# EasyEDA Pro project ProProject_3516_307_8731_devboard_V1.1_2024-05-14.epro, schematic 3516aio_v1p1
Create Date: 2024-05-11; Page Name: P1; Project Name: hi3516ev200_imx307_rtl8731bu_aio_v1p1_rel; Schematic Name: Schematic1_2; Update Date: 2024-05-11; Company: 嘉立创EDA; Drawed: @libc0607; Page Size: A4; Version: V1.0
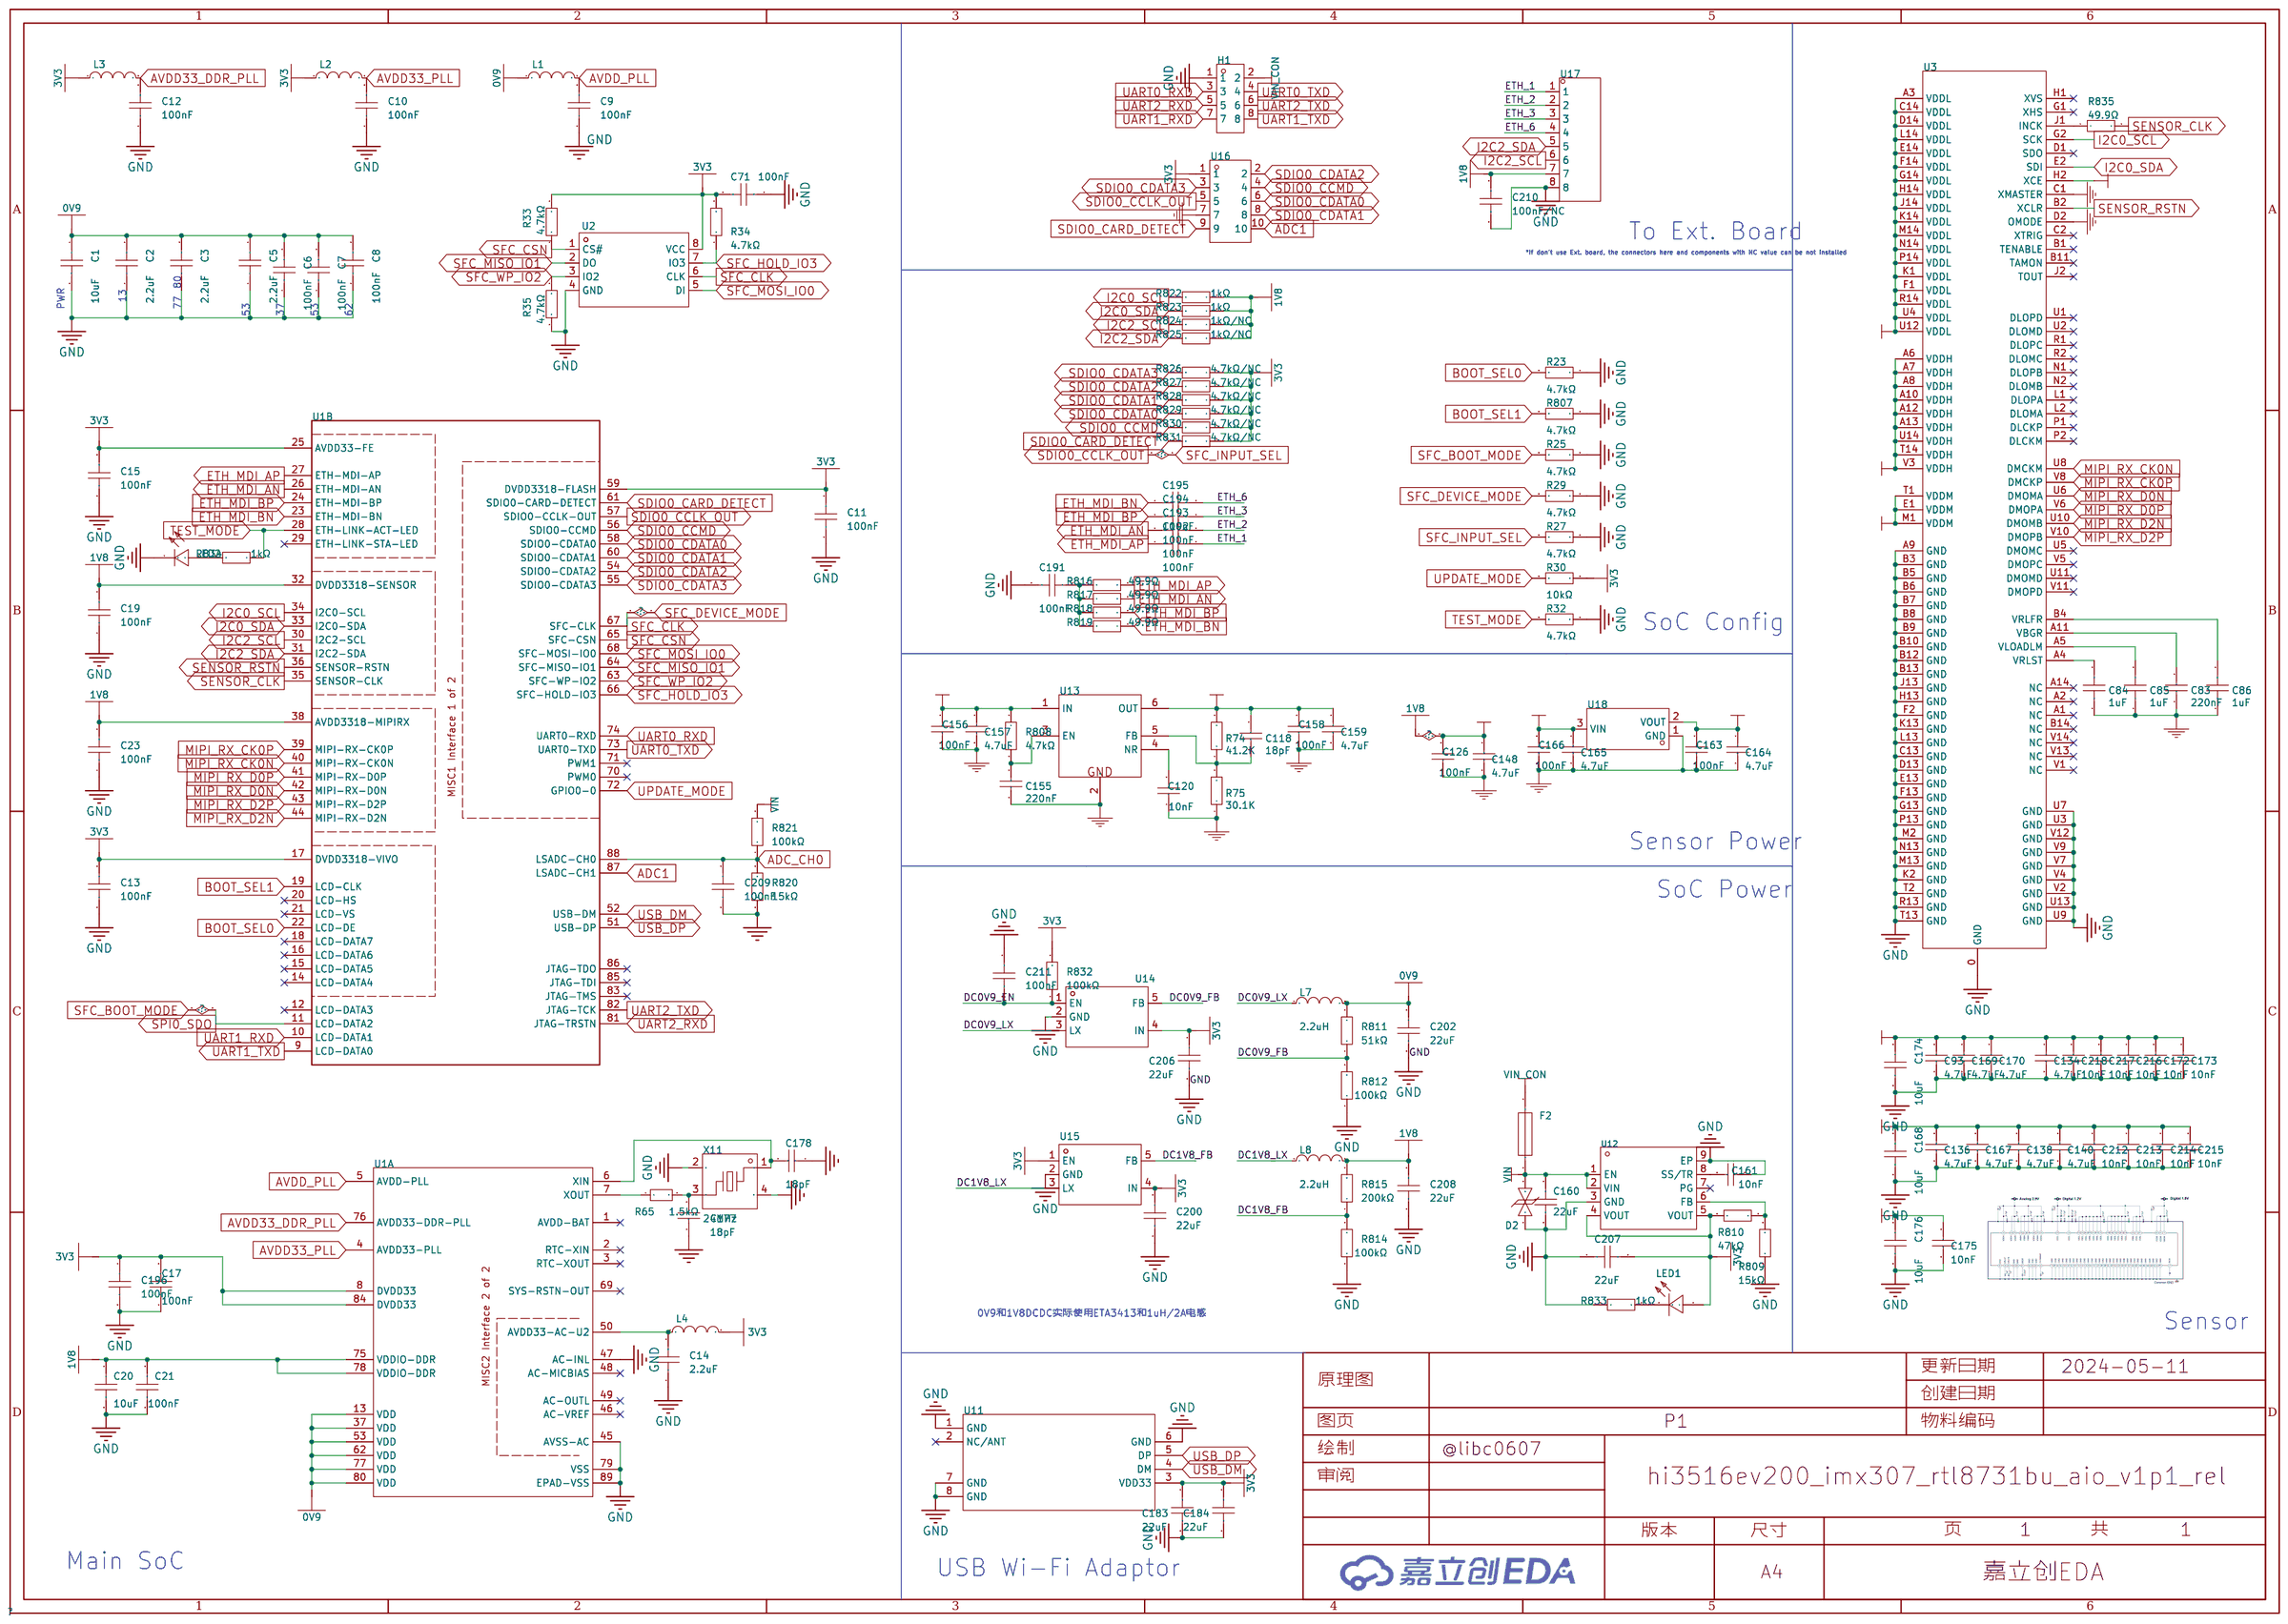
[diagram p0: schematic sheet]

## Parts
C1  10uF  [0402]
C2  2.2uF  [0402]
C3  2.2uF  [0402]
C5  2.2uF  [0402]
C6  100nF  [0402]
C7  100nF  [0402]
C8  100nF  [0402]
C9  100nF  [0402]
C10  100nF  [0402]
C11  100nF  [0402]
C12  100nF  [0402]
C13  100nF  [0402]
C14  2.2uF  [0402]
C15  100nF  [0402]
C17  100nF  [0402]
C19  100nF  [0402]
C20  10uF  [0402]
C21  100nF  [0402]
C23  100nF  [0402]
C71  100nF  [0402]
C83  220nF  [0402]
C84  1uF  [0402]
C85  1uF  [0402]
C86  1uF  [0402]
C93  4.7uF  [0402]
C118  18pF  [0402]
C120  10nF  [0402]
C126  100nF  [0402]
C134  4.7uF  [0402]
C136  4.7uF  [0402]
C138  4.7uF  [0402]
C140  4.7uF  [0402]
C148  4.7uF  [0402]
C155  220nF  [0402]
C156  100nF  [0402]
C157  4.7uF  [0402]
C158  100nF  [0402]
C159  4.7uF  [0402]
C160  22uF  [0805]
C161  10nF  [0402]
C163  100nF  [0402]
C164  4.7uF  [0402]
C165  4.7uF  [0402]
C166  100nF  [0402]
C167  4.7uF  [0402]
C168  10uF  [0402]
C169  4.7uF  [0402]
C170  4.7uF  [0402]
C172  10nF  [0402]
C173  10nF  [0402]
C174  10uF  [0402]
C175  10nF  [0402]
C176  10uF  [0402]
C177  18pF  [0402]
C178  18pF  [0402]
C183  22uF  [0805]
C184  22uF  [0805]
C191  100nF  [0402]
C192  100nF  [0402]
C193  100nF  [0402]
C194  100nF  [0402]
C195  100nF  [0402]
C196  100nF  [0402]
C200  22uF  [0603]
C202  22uF  [0603]
C206  22uF  [0805]
C207  22uF  [0805]
C208  22uF  [0805]
C209  100nF  [0402]
C210  100nF/NC  [0402]
C211  100nF  [0402]
C212  10nF  [0402]
C213  10nF  [0402]
C214  10nF  [0402]
C215  10nF  [0402]
C216  10nF  [0402]
C217  10nF  [0402]
C218  10nF  [0402]
D2  PESD12VL1BA-N  [SOD-323_L1.8-W1.3-LS2.5-BI]
F2  BSMD0805-075-12V  [F0805]
H1  PM127V-12-08-H43  [HDR-TH_8P-P1.27-V-F-R2-C4-S1.27]
L1  -  [0402]
L2  -  [0402]
L3  -  [0402]
L4  -  [0402]
L7  2.2uH  [0805]
L8  2.2uH  [0805]
LED1  KT-0603R  [0603]
LED2  19-213/Y2C-CQ2R2L/3T(CY)  [0603]
R23  4.7kΩ  [0402]
R25  4.7kΩ  [0402]
R27  4.7kΩ  [0402]
R29  4.7kΩ  [0402]
R30  10kΩ  [0402]
R32  4.7kΩ  [0402]
R33  4.7kΩ  [0402]
R34  4.7kΩ  [0402]
R35  4.7kΩ  [0402]
R65  1.5kΩ  [0402]
R74  41.2K  [0402]
R75  30.1K  [0402]
R807  4.7kΩ  [0402]
R808  4.7kΩ  [0402]
R809  15kΩ  [0402]
R810  47kΩ  [0402]
R811  51kΩ  [0402]
R812  100kΩ  [0402]
R814  100kΩ  [0402]
R815  200kΩ  [0402]
R816  49.9Ω  [0402]
R817  49.9Ω  [0402]
R818  49.9Ω  [0402]
R819  49.9Ω  [0402]
R820  15kΩ  [0402]
R821  100kΩ  [0402]
R822  1kΩ  [0402]
R823  1kΩ  [0402]
R824  1kΩ/NC  [0402]
R825  1kΩ/NC  [0402]
R826  4.7kΩ/NC  [0402]
R827  4.7kΩ/NC  [0402]
R828  4.7kΩ/NC  [0402]
R829  4.7kΩ/NC  [0402]
R830  4.7kΩ/NC  [0402]
R831  4.7kΩ/NC  [0402]
R832  100kΩ  [0402]
R833  1kΩ  [0402]
R834  1kΩ  [0402]
R835  49.9Ω  [0402]
U1  -  [QFN-88 L9.0-W9.0-P0.35-BL-EP5.26]  (sections 1,2)
U2  -  [SOIC-8_L5.3-W5.3-P1.27-LS8.0-BL]
U3  -  [IMX307LQD-C__NO_IRCUT]
U11  -  [BL-M8731BU4]
U12  TPS82130SILR  [USIP-8_L3.0-W2.8-P0.65-TL-EP]
U13  TPS79301DBVR  [SOT-23-6_L2.9-W1.6-P0.95-LS2.8-BR]
U14  SY8088AAC  [SOT-23-5_L3.0-W1.7-P0.95-LS2.8-BR]
U15  SY8088AAC  [SOT-23-5_L3.0-W1.7-P0.95-LS2.8-BR]
U16  ZX-PM1.27-2-5PU  [HDR-TH_10P-P1.27-V-F-R2-C5-S1.27]
U17  2343U-108CNG1SNT01  [HDR-TH_8P-P1.27-V-F]
U18  XC6206P122MR(1uA)  [SOT-23-3_L2.9-W1.6-P1.90-LS2.8-BR]
X11  24MHz  [CRYSTAL-SMD_4P-L2.0-W1.6-BL]

## Library data of the parts
C1-C3 C5-C15 C17 C19-C21 C23 C71 C168 C174 C176 C191-C196 C209 C211 = CC0402KRX7R7BB104: 容值:100nF;精度:±10%;额定电压:16V;材质(温度系数):X7R;; LCSC Part Name: 100nF ±10% 16V; Supplier Part: C15195; Manufacturer: YAGEO(国巨); JLCPCB Part Class: Extended Part; Datasheet: https://atta.szlcsc.com/upload/public/pdf/source/20211223/9278FD768280B81DDBEF48FA36411A03.pdf; Supplier: LCSC; Tolerance: ±10%; Voltage Rated: 16V; Temperature Coefficient: X7R
C83 C155 = CL05B224KO5NNNC: Supplier: LCSC; Manufacturer: SAMSUNG; Supplier Part: C15195; JLCPCB Part Class: Basic
C84-C86 = CL05A105KA5NQNC: Supplier: LCSC; Manufacturer: SAMSUNG; Supplier Part: C15195; JLCPCB Part Class: Basic
C93 C134 C136 C138 C140 C148 C157 C159 C164 C165 C167 C169 C170 = CL05A475MP5NRNC: Supplier: LCSC; Manufacturer: SAMSUNG; Supplier Part: C15195; JLCPCB Part Class: Basic
C118 = 0402CG180J500NT: Supplier: LCSC; Manufacturer: FH; Supplier Part: C15195; JLCPCB Part Class: Basic
C120 C161 C172 C173 C175 C212-C218 = CL05B103KB5NNNC: Supplier: LCSC; Manufacturer: SAMSUNG; Supplier Part: C15195; JLCPCB Part Class: Basic
C126 C156 C158 C163 C166 = CL05B104KO5NNNC: Supplier: LCSC; Manufacturer: SAMSUNG; Supplier Part: C15195; JLCPCB Part Class: Basic
C160 C183 C184 C206-C208 = CL21A226MAQNNNE: 容值:22uF;精度:±20%;额定电压:25V;材质(温度系数):X5R;; LCSC Part Name: 22uF ±20% 25V; Supplier Part: C2838369; Manufacturer: SAMSUNG(三星); JLCPCB Part Class: 基础库; Datasheet: https://atta.szlcsc.com/upload/public/pdf/source/20160218/1457707763339.pdf; Supplier: LCSC; Tolerance: ±20%; Voltage Rated: 25V; Temperature Coefficient: X5R
C177 C178 = 0402CG180J500NT: 容值:18pF;精度:±5%;额定电压:50V;材质(温度系数):C0G;; LCSC Part Name: 18pF ±5% 50V; Supplier Part: C15195; Manufacturer: FH(风华); JLCPCB Part Class: 基础库; Datasheet: https://atta.szlcsc.com/upload/public/pdf/source/20200305/C486355_26A10D38EF8C2A5C37091D0039909270.pdf; Supplier: LCSC; Tolerance: ±5%; Voltage Rated: 50V; Temperature Coefficient: C0G
C200 C202 = CL10A226MQ8NRNC: 容值:22uF;精度:±20%;额定电压:6.3V;材质(温度系数):X5R;; LCSC Part Name: 22uF ±20% 6.3V; Supplier Part: C72038; Manufacturer: SAMSUNG(三星); JLCPCB Part Class: 基础库; Datasheet: https://atta.szlcsc.com/upload/public/pdf/source/20160218/1457707763339.pdf; Supplier: LCSC; Tolerance: ±20%; Voltage Rated: 6.3V; Temperature Coefficient: X5R
C210 = CC0402KRX7R7BB104: 容值:100nF;精度:±10%;额定电压:16V;材质(温度系数):X7R;; LCSC Part Name: 100nF ±10% 16V; Supplier Part: C60474; Manufacturer: YAGEO(国巨); JLCPCB Part Class: Extended Part; Datasheet: https://atta.szlcsc.com/upload/public/pdf/source/20211223/9278FD768280B81DDBEF48FA36411A03.pdf; Supplier: LCSC; Tolerance: ±10%; Voltage Rated: 16V; Temperature Coefficient: X7R
D2 = PESD12VL1BA-N: 极性:双向;反向截止电压(Vrwm):12V;最大钳位电压:26V;峰值脉冲电流(Ipp)@10/1000us:10A;击穿电压:13.3V;; LCSC Part Name: 双向ESD; Supplier Part: C314261; Manufacturer: BORN(伯恩半导体); Supplier Footprint: SOD-323; Datasheet: https://atta.szlcsc.com/upload/public/pdf/source/20181015/C314261_4290A578F6A9FDD8EB59F3EEFCEB14F5.pdf; Supplier: LCSC; polarity: 双向; Reverse Stand-Off Voltage (Vrwm): 12V; Maximum Clamping Voltage: 26V; Peak Pulse Current (Ipp)@10/1000us: 10A; Breakdown Voltage: 13.3V; Type: ESD
F2 = BSMD0805-075-12V: 最大电压:12V;最大电流:40A;保持电流:750mA;跳闸电流:1.5A;; LCSC Part Name: 12V 750mA 0805自恢复; Supplier Part: C883111; Manufacturer: BHFUSE(佰宏); Supplier Footprint: 0805; JLCPCB Part Class: 扩展库; Datasheet: https://atta.szlcsc.com/upload/public/pdf/source/20230512/7A46D6CD923C15CBB98FD769C08EDD80.pdf; Supplier: LCSC; Operating Voltage (Max): 12V; Current Rating (Max): 40A; Hold Current: 750mA; Trip Current: 1.5A; Power Dissipation: 600mW; Resistance - Initial (Ri) (Min): 70mΩ; Resistance - Post Trip (R1) (Max): 385mΩ; Maximum Time to Trip: 200ms; Operating Temperature: -40℃~+85℃
H1 = PM127V-12-08-H43: 排数:双排;总孔位数:8P;间距:1.27mm;插孔结构:2x4P;行距:1.27mm;安装类型:直插;圆孔/方孔:方孔;额定电流:1A;额定电压:250V;插孔方向:顶部;塑高:4.3mm;工作温度范围:-40℃~+105℃;; Supplier: LCSC; Supplier Part: C509139; Manufacturer: XFCN(兴飞); JLCPCB Part Class: 扩展库; LCSC Part Name: 间距:1.27mm 2x4P 直插; Supplier Footprint: 插件,P=1.27mm; Datasheet: https://atta.szlcsc.com/upload/public/pdf/source/20200407/C509139_3A6F8716DF7D61918E79FF2BB2D94EF1.pdf; Number of Rows: 双排; Number of Holes: 8P; Pitch: 1.27mm; Holes Structure: 2x4P; Row Spacing: 1.27mm; Mounting Type: 直插; Circular Hole / Square Hole: 方孔; Current Rating (Max): 1A; Voltage Rating (Max): 250V; Holes Direction: 顶部; Insulation Height: 4.3mm; Operating Temperature Range: -40℃~+105℃
L1-L4 = BLM15HG102SN1D: 标称阻抗@测试频率:1kΩ@100MHz;误差:±25%;直流电阻(RDC):1.1Ω;额定电流:250mA;电路数:1;; LCSC Part Name: 1kΩ@100MHz ±25%; Supplier Part: C15195; Manufacturer: muRata(村田); JLCPCB Part Class: Extended Part; Datasheet: https://atta.szlcsc.com/upload/public/pdf/source/20190514/C76889_F0F83FCD49F4171101F490FA7BA9BBE1.pdf; Supplier: LCSC; Impedance @ Frequency: 1kΩ@100MHz; Tolerance: ±25%; DC Resistance: 1.1Ω; Current Rating: 250mA; Circuits: 1
L7 L8 = DFE201612E-2R2M=P2: 电感值:2.2uH;精度:±20%;额定电流:1.8A;饱和电流(Isat):2.4A;类型:-;; LCSC Part Name: 2.2uH ±20% 2.4A; Supplier Part: C337893; Manufacturer: muRata(村田); Supplier Footprint: 0806; JLCPCB Part Class: 扩展库; Datasheet: https://atta.szlcsc.com/upload/public/pdf/source/20190227/C337893_7FE30528A4C33F920D01E38BD9851F7D.pdf; Supplier: LCSC; Tolerance: ±20%; Rated Current: 1.8A; Saturation Current (Isat): 2.4A; DC Resistance (DCR): 116mΩ
LED1 = KT-0603R: 发光颜色:红色;功率:-;正向电流:-;主波长:-;二极管配置:-;透镜颜色:-;色温:-;发光角度:-;载带方式:-;工作温度:-40℃~+85℃;; LCSC Part Name: 0603 红灯 高亮; Supplier Part: C72038; Manufacturer: KENTO; JLCPCB Part Class: 基础库; Datasheet: https://atta.szlcsc.com/upload/public/pdf/source/20160616/1466072038404.pdf; Supplier: LCSC; Emitted Color: 红色; Operating Temperature: -40℃~+85℃
LED2 = 19-213/Y2C-CQ2R2L/3T(CY): 发光颜色:黄色;功率:60mW;正向电流:20mA;主波长:585.5nm~591.5nm;二极管配置:-;透镜颜色:无色透明透镜;色温:-;发光角度:120°;载带方式:-;工作温度:-40℃~+85℃;; LCSC Part Name: 黄灯; Supplier Part: C72038; Manufacturer: EVERLIGHT(亿光); JLCPCB Part Class: 基础库; Datasheet: https://atta.szlcsc.com/upload/public/pdf/source/20160507/1462613613586.pdf; Supplier: LCSC; Emitted Color: 黄色; Power Dissipation: 60mW; Forward Current: 20mA; Dominant Wavelength: 585.5nm~591.5nm; Peak Wavelength: 591nm; Lens Color: 无色透明透镜; Viewing Angle: 120°; Operating Temperature: -40℃~+85℃
R23 R25 R27 R29 R32 R807 R808 R826-R831 = 0402WGF4701TCE: 电阻类型:厚膜电阻;阻值:4.7kΩ;精度:±1%;功率:62.5mW;; LCSC Part Name: 4.7kΩ ±1% 62.5mW; Supplier Part: C25900; Manufacturer: UNI-ROYAL(厚声); JLCPCB Part Class: Basic Part; Datasheet: https://atta.szlcsc.com/upload/public/pdf/source/20200306/C422600_1E6D84923E4A46A82E41ADD87F860B5C.pdf; Supplier: LCSC; Type: 厚膜电阻; Tolerance: ±1%; Power(Watts): 62.5mW; Temperature Coefficient: ±100ppm/℃; Overload Voltage (Max): 50V; Operating Temperature Range: -55℃~+155℃
R30 = 0402WGF1002TCE: 电阻类型:厚膜电阻;阻值:10kΩ;精度:±1%;功率:62.5mW;; LCSC Part Name: 10kΩ ±1% 62.5mW; Supplier Part: C15195; Manufacturer: UNI-ROYAL(厚声); JLCPCB Part Class: Basic Part; Datasheet: https://atta.szlcsc.com/upload/public/pdf/source/20200306/C422600_1E6D84923E4A46A82E41ADD87F860B5C.pdf; Supplier: LCSC; Type: 厚膜电阻; Tolerance: ±1%; Power(Watts): 62.5mW; Temperature Coefficient: ±100ppm/℃; Overload Voltage (Max): 50V; Operating Temperature Range: -55℃~+155℃
R33-R35 = 0402WGF4701TCE: 阻值:4.7kΩ;精度:±1%;功率:1/16W;温度系数:±100ppm/;最大工作电压:50V;工作温度范围:-55~+155;; LCSC Part Name: 4.7kΩ ±1% 1/16W; Supplier Part: C15195; Manufacturer: UNI-ROYAL(厚声); JLCPCB Part Class: Basic Part; Datasheet: https://atta.szlcsc.com/upload/public/pdf/source/20200306/C422600_1E6D84923E4A46A82E41ADD87F860B5C.pdf; Supplier: LCSC; Type: 厚膜电阻; Tolerance: ±1%; Power(Watts): 1/16W; Temperature Coefficient: ±100ppm/℃; Overload Voltage (Max): 50V; Operating Temperature Range: -55℃~+155℃
R65 = R0402-10K: 电阻类型:厚膜电阻;阻值:10kΩ;精度:±1%;功率:1/16W;温度系数:±100ppm/;最大工作电压:50V;工作温度范围:-55~+155;; LCSC Part Name: 10kΩ ±1%; Supplier Part: C15195; Manufacturer: UNI-ROYAL(厚声); Manufacturer Part: 0402WGF1002TCE; JLCPCB Part Class: Basic Part; Datasheet: https://atta.szlcsc.com/upload/public/pdf/source/20200306/C422600_1E6D84923E4A46A82E41ADD87F860B5C.pdf; Supplier: LCSC; Type: 厚膜电阻; Tolerance: ±1%; Power(Watts): 1/16W; Temperature Coefficient: ±100ppm/; Overload Voltage (Max): 50V; Operating Temperature Range: -55~+155
R74 = 0402WGF4122TCE: Supplier: LCSC; Manufacturer: UniOhm; Supplier Part: C15195; JLCPCB Part Class: Extend
R75 = 0402WGF3012TCE: Supplier: LCSC; Manufacturer: UniOhm; Supplier Part: C15195; JLCPCB Part Class: Extend
R809 R820 = 0402WGF1502TCE: 电阻类型:厚膜电阻;阻值:15kΩ;精度:±1%;功率:62.5mW;最大工作电压:50V;温度系数:±100ppm/℃;; LCSC Part Name: 15kΩ ±1% 62.5mW 厚膜电阻; Supplier Part: C15195; Manufacturer: UNI-ROYAL(厚声); JLCPCB Part Class: 基础库; Datasheet: https://atta.szlcsc.com/upload/public/pdf/source/20200306/C422600_1E6D84923E4A46A82E41ADD87F860B5C.pdf; Supplier: LCSC; Type: 厚膜电阻; Tolerance: ±1%; Power(Watts): 62.5mW; Overload Voltage (Max): 50V; Temperature Coefficient: ±100ppm/℃; Operating Temperature Range: -55℃~+155℃
R810 = 0402WGF4702TCE: 电阻类型:厚膜电阻;阻值:47kΩ;精度:±1%;功率:62.5mW;最大工作电压:50V;温度系数:±100ppm/℃;; LCSC Part Name: 47kΩ ±1% 62.5mW 厚膜电阻; Supplier Part: C15195; Manufacturer: UNI-ROYAL(厚声); JLCPCB Part Class: 基础库; Datasheet: https://atta.szlcsc.com/upload/public/pdf/source/20200306/C422600_1E6D84923E4A46A82E41ADD87F860B5C.pdf; Supplier: LCSC; Type: 厚膜电阻; Tolerance: ±1%; Power(Watts): 62.5mW; Overload Voltage (Max): 50V; Temperature Coefficient: ±100ppm/℃; Operating Temperature Range: -55℃~+155℃
R811 = 0402WGF5102TCE: 电阻类型:厚膜电阻;阻值:51kΩ;精度:±1%;功率:62.5mW;最大工作电压:50V;温度系数:±100ppm/℃;; LCSC Part Name: 51kΩ ±1% 62.5mW 厚膜电阻; Supplier Part: C15195; Manufacturer: UNI-ROYAL(厚声); JLCPCB Part Class: 基础库; Datasheet: https://atta.szlcsc.com/upload/public/pdf/source/20200306/C422600_1E6D84923E4A46A82E41ADD87F860B5C.pdf; Supplier: LCSC; Type: 厚膜电阻; Tolerance: ±1%; Power(Watts): 62.5mW; Overload Voltage (Max): 50V; Temperature Coefficient: ±100ppm/℃; Operating Temperature Range: -55℃~+155℃
R812 R814 R821 R832 = 0402WGF1003TCE: 电阻类型:厚膜电阻;阻值:100kΩ;精度:±1%;功率:62.5mW;最大工作电压:50V;温度系数:±100ppm/℃;; LCSC Part Name: 100kΩ ±1% 62.5mW 厚膜电阻; Supplier Part: C15195; Manufacturer: UNI-ROYAL(厚声); JLCPCB Part Class: 基础库; Datasheet: https://atta.szlcsc.com/upload/public/pdf/source/20200306/C422600_1E6D84923E4A46A82E41ADD87F860B5C.pdf; Supplier: LCSC; Type: 厚膜电阻; Tolerance: ±1%; Power(Watts): 62.5mW; Overload Voltage (Max): 50V; Temperature Coefficient: ±100ppm/℃; Operating Temperature Range: -55℃~+155℃
R815 = 0402WGF2003TCE: 电阻类型:厚膜电阻;阻值:200kΩ;精度:±1%;功率:62.5mW;最大工作电压:50V;温度系数:±100ppm/℃;; LCSC Part Name: 200kΩ ±1% 62.5mW 厚膜电阻; Supplier Part: C15195; Manufacturer: UNI-ROYAL(厚声); JLCPCB Part Class: 基础库; Datasheet: https://atta.szlcsc.com/upload/public/pdf/source/20200306/C422600_1E6D84923E4A46A82E41ADD87F860B5C.pdf; Supplier: LCSC; Type: 厚膜电阻; Tolerance: ±1%; Power(Watts): 62.5mW; Overload Voltage (Max): 50V; Temperature Coefficient: ±100ppm/℃; Operating Temperature Range: -55℃~+155℃
R816-R819 R835 = 0402WGF499JTCE: LCSC Part Name: 49.9Ω ±1% 62.5mW; Supplier Part: C15195; Manufacturer: UNI-ROYAL(厚声); JLCPCB Part Class: 基础库; Datasheet: https://atta.szlcsc.com/upload/public/pdf/source/20200306/C422600_1E6D84923E4A46A82E41ADD87F860B5C.pdf; Supplier: LCSC; Type: 厚膜电阻; Tolerance: ±1%; Power(Watts): 62.5mW; Temperature Coefficient: ±100ppm/℃; Overload Voltage (Max): 50V; Operating Temperature Range: -55℃~+155℃
R822 R823 R833 R834 = 0402WGF1001TCE: 电阻类型:厚膜电阻;阻值:1kΩ;精度:±1%;功率:62.5mW;最大工作电压:50V;温度系数:±100ppm/℃;; LCSC Part Name: 1kΩ ±1% 62.5mW 厚膜电阻; Supplier Part: C15195; Manufacturer: UNI-ROYAL(厚声); JLCPCB Part Class: Basic Part; Datasheet: https://atta.szlcsc.com/upload/public/pdf/source/20200306/C422600_1E6D84923E4A46A82E41ADD87F860B5C.pdf; Supplier: LCSC; Type: 厚膜电阻; Tolerance: ±1%; Power(Watts): 62.5mW; Overload Voltage (Max): 50V; Temperature Coefficient: ±100ppm/℃; Operating Temperature Range: -55℃~+155℃
R824 R825 = 0402WGF1001TCE: 电阻类型:厚膜电阻;阻值:1kΩ;精度:±1%;功率:62.5mW;最大工作电压:50V;温度系数:±100ppm/℃;; LCSC Part Name: 1kΩ ±1% 62.5mW 厚膜电阻; Supplier Part: C11702; Manufacturer: UNI-ROYAL(厚声); JLCPCB Part Class: Basic Part; Datasheet: https://atta.szlcsc.com/upload/public/pdf/source/20200306/C422600_1E6D84923E4A46A82E41ADD87F860B5C.pdf; Supplier: LCSC; Type: 厚膜电阻; Tolerance: ±1%; Power(Watts): 62.5mW; Overload Voltage (Max): 50V; Temperature Coefficient: ±100ppm/℃; Operating Temperature Range: -55℃~+155℃
U1 = Hi3516EV200: Supplier Part: C2802265
U2 = W25Q128JVSIQ: 存储器构架(格式):FLASH;存储器接口类型:SPI - Dual/Quad I/O;存储器容量:128Mb (16M x 8);; Supplier Part: C97521; Manufacturer: WINBOND(华邦); Supplier Footprint: SOIC-8_208mil; JLCPCB Part Class: Basic Part; Datasheet: https://atta.szlcsc.com/upload/public/pdf/source/20170316/1489627409956.pdf; Supplier: LCSC; Memory Format: FLASH; Memory Interface: SPI - Dual/Quad I/O; Memory Size: 128Mb (16M x 8); Voltage - Supply: 2.7V ~ 3.6V
U3 = IMX307LQD-C: Supplier Part: C2940553
U11 = BL-M8731BU4: Supplier Part: C19184601
U12 = TPS82130SILR: 输入电压(DC):3V~17V;输出电压:900mV~6V;输出电流(最大值):3A;功能类型:-;; Supplier Part: C473914; Manufacturer: TI(德州仪器); Supplier Footprint: USIP-8; JLCPCB Part Class: 扩展库; Datasheet: https://www.ti.com/cn/lit/gpn/tps82130; Supplier: LCSC; Input Voltage(DC): 3V~17V; Output Voltage: 900mV~6V; Output Current (Max): 3A; Output Channel: 1
U13 = TPS79301DBVR: 输出类型:可调;最大输入电压:5.5V;输出电压:1.22V~5.5V;最大输出电流:200mA;电源纹波抑制比(PSRR):70dB;输出极性:正极;; LCSC Part Name: ADJ 输入5.5V 输出1.22V~5.5V 200mA; Supplier Part: C37151; Manufacturer: TI(德州仪器); Supplier Footprint: SOT-23-6; JLCPCB Part Class: 扩展库; Datasheet: https://www.ti.com/cn/lit/gpn/tps793; Supplier: LCSC; Output Type: 可调; Maximum Input Voltage: 5.5V; Output Voltage: 1.22V~5.5V; MAX Output Current: 200mA; Power Supply Rejection Ratio (PSRR): 70dB; standby current: 220uA; Operating Temperature: -40℃~+150℃; Output Polarity: 正极; Number of Outputs: 1
U14 U15 = SY8088AAC: 功能类型:降压型;输入电压:-;输出电流(最大值):-;; Supplier Part: C79313; Manufacturer: silergy(矽力杰); Supplier Footprint: SOT-23-5; JLCPCB Part Class: 扩展库; Datasheet: https://atta.szlcsc.com/upload/public/pdf/source/20170329/1490752163260.pdf; Supplier: LCSC; Function: 降压型; Switch tube (built-in/external): 内置
U16 = ZX-PM1.27-2-5PU: 插孔结构:2x5P;间距:1.27mm;行距:1.27mm;圆孔/方孔:方孔;安装类型:直插;排数:双排;总孔位数:5P;额定电流:3A;额定电压:1kV;插孔方向:顶部;塑高:4.3mm;触头材质:青铜;触头镀层:金;工作温度范围:-40℃~+105℃;焊接温度(最大值):260℃@5S;; LCSC Part Name: 间距:1.27mm 2x5P 直插; Supplier Part: C7499360; Manufacturer: Megastar(兆星); Supplier Footprint: 插件,P=1.27mm; JLCPCB Part Class: 扩展库; Datasheet: https://atta.szlcsc.com/upload/public/pdf/source/20231122/798A0B43FE40C2696C864C3AF1DD2833.pdf; Supplier: LCSC; Holes Structure: 2x5P; Pitch: 1.27mm; Row Spacing: 1.27mm; Circular Hole / Square Hole: 方孔; Mounting Type: 直插; Number of Rows: 双排; Number of Holes: 5P; Current Rating (Max): 3A; Voltage Rating (Max): 1kV; Holes Direction: 顶部; Insulation Height: 4.3mm; Contact Material: 青铜; Contact Plating: 金; Operating Temperature Range: -40℃~+105℃; Soldering Temperature(Max): 260℃@5S
U17 = 2343U-108CNG1SNT01: 排数:单排;总孔位数:8;间距:1.27mm;插孔结构:1x8P;行距:-;安装类型:直插;塑高:-;触头材质:磷青铜;触头镀层:-;; LCSC Part Name: 1.27mm 1x8P U型/环保耐高温/镀金; Supplier Part: C350285; Manufacturer: 华宇创; Supplier Footprint: 插件,P=1.27mm; JLCPCB Part Class: 扩展库; Datasheet: https://atta.szlcsc.com/upload/public/pdf/source/20181220/C350285_B1491C175F7457F2F9F66A44FE3A8EC0.pdf; Supplier: LCSC; Number of Rows: 单排; Number of Holes: 8; Pitch: 1.27mm; Holes Structure: 1x8P; Mounting Type: 直插; Contact Material: 磷青铜
U18 = XC6206P122MR(1uA): 输出类型:-;; Supplier Part: C2827649; Manufacturer: TECH PUBLIC(台舟); Supplier Footprint: SOT-23-3L; JLCPCB Part Class: 扩展库; Datasheet: https://atta.szlcsc.com/upload/public/pdf/source/20210427/C2827649_24A8EEF49F85A7F9CB1A2467D089223A.pdf; Supplier: LCSC
X11 = XL7EL89CMI-111YLC-24M: 晶振类型:贴片晶振;频率:24MHz;常温频差:±10ppm;外接负载电容:10pF;频率稳定度(全温):±20ppm;; LCSC Part Name: 24MHz ±10ppm 10pF; Supplier Part: C2965581; Manufacturer: YXC(扬兴晶振); Supplier Footprint: SMD2016-4P; JLCPCB Part Class: 扩展库; Datasheet: https://atta.szlcsc.com/upload/public/pdf/source/20240329/C26C9A15A73CBCFBF373B30A8E126750.pdf; Supplier: LCSC; Crystal Type: 贴片晶振; Normal temperature Frequency Tolerance: ±10ppm; External load capacitor: 10pF; Frequency Stability(Full temperature range): ±20ppm; Operating Temperature: -40℃~+85℃

## Nets
0V9: C1.1 C2.2 C3.2 C5.2 C6.2 C7.2 C8.2 C202.2 L1.1 L7.2 R811.2 U1.13(VDD) U1.37(VDD) U1.53(VDD) U1.62(VDD) U1.77(VDD) U1.80(VDD)
1V2_SNS: C93.1 C134.1 C163.2 C164.1 C169.1 C170.1 C172.1 C173.1 C174.1 C216.1 C217.1 C218.1 U3.A3(VDDL) U3.C14(VDDL) U3.D14(VDDL) U3.E14(VDDL) U3.F1(VDDL) U3.F14(VDDL) U3.G14(VDDL) U3.H14(VDDL) U3.J14(VDDL) U3.K1(VDDL) U3.K14(VDDL) U3.L14(VDDL) U3.M14(VDDL) U3.N14(VDDL) U3.P14(VDDL) U3.R14(VDDL) U3.U4(VDDL) U3.U12(VDDL) U18.2(VOUT)
1V8: C19.2 C20.1 C21.2 C23.2 C126.2 C148.1 C175.1 C176.1 C208.2 C210.2 L8.2 R815.2 R822.1 R823.1 R824.1 R825.1 U1.32(DVDD3318-SENSOR) U1.38(AVDD3318-MIPIRX) U1.75(VDDIO-DDR) U1.78(VDDIO-DDR) U3.E1(VDDM) U3.H2(XCE) U3.M1(VDDM) U3.T1(VDDM) U17.7
2V9_SNS: C118.2 C136.1 C138.1 C140.1 C158.2 C159.1 C167.1 C168.1 C212.1 C213.1 C214.1 C215.1 R74.2 U3.A6(VDDH) U3.A7(VDDH) U3.A8(VDDH) U3.A10(VDDH) U3.A12(VDDH) U3.A13(VDDH) U3.T14(VDDH) U3.U14(VDDH) U3.V3(VDDH) U13.6(OUT)
3V3: C11.2 C13.2 C15.2 C17.2 C71.2 C156.2 C157.1 C165.1 C166.2 C183.1 C184.1 C196.1 C200.2 C206.1 C207.2 L2.1 L3.1 L4.2 LED1.2(A) R30.2 R33.2 R34.2 R808.1 R810.2 R826.1 R827.1 R828.1 R829.1 R830.1 R831.1 R832.2 U1.8(DVDD33) U1.17(DVDD3318-VIVO) U1.25(AVDD33-FE) U1.59(DVDD3318-FLASH) U1.84(DVDD33) U2.8(VCC) U11.3(VDD33) U12.4(VOUT) U12.5(VOUT) U13.1(IN) U14.4(IN) U15.1(EN) U15.4(IN) U16.1 U18.3(VIN)
AVDD33_DDR_PLL: C12.2 L3.2 U1.76(AVDD33-DDR-PLL)
AVDD33_PLL: C10.2 L2.2 U1.4(AVDD33-PLL)
AVDD_PLL: C9.2 L1.2 U1.5(AVDD-PLL)
GND: C1.2 C2.1 C3.1 C5.1 C6.1 C7.1 C8.1 C9.1 C10.1 C11.1 C12.1 C13.1 C14.1 C15.1 C17.1 C19.1 C20.2 C21.1 C23.1 C71.1 C83.1 C84.1 C85.1 C86.1 C93.2 C120.1 C126.1 C134.2 C136.2 C138.2 C140.2 C148.2 C155.1 C156.1 C157.2 C158.1 C159.2 C160.2 C161.1 C163.1 C164.2 C165.2 C166.1 C167.2 C168.2 C169.2 C170.2 C172.2 C173.2 C174.2 C175.2 C176.2 C177.1 C178.1 C183.2 C184.2 C191.2 C196.2 C200.1 C202.1 C206.2 C207.1 C208.1 C209.2 C210.1 C211.1 C212.2 C213.2 C214.2 C215.2 C216.2 C217.2 C218.2 D2.1 H1.1 LED2.1(C) R23.1 R25.1 R27.1 R29.1 R32.1 R35.1 R75.1 R807.1 R809.1 R812.1 R814.1 R820.2 R833.2 U1.45(AVSS-AC) U1.47(AC-INL) U1.79(VSS) U1.89(EPAD-VSS) U2.4(GND) U3.0(GND) U3.A9(GND) U3.B3(GND) U3.B5(GND) U3.B6(GND) U3.B7(GND) U3.B8(GND) U3.B9(GND) U3.B10(GND) U3.B12(GND) U3.B13(GND) U3.C1(XMASTER) U3.C13(GND) U3.D2(OMODE) U3.D13(GND) U3.E13(GND) U3.F2(GND) U3.F13(GND) U3.G13(GND) U3.H13(GND) U3.J13(GND) U3.K2(GND) U3.K13(GND) U3.L13(GND) U3.M2(GND) U3.M13(GND) U3.N13(GND) U3.P13(GND) U3.R13(GND) U3.T2(GND) U3.T13(GND) U3.U3(GND) U3.U7(GND) U3.U9(GND) U3.U13(GND) U3.V2(GND) U3.V4(GND) U3.V7(GND) U3.V9(GND) U3.V12(GND) U11.1(GND) U11.6(GND) U11.7(GND) U11.8(GND) U12.3(GND) U12.9(EP) U13.2(GND) U14.2(GND) U15.2(GND) U16.7 U17.8 U18.1(GND) X11.2(GND) X11.4(GND)
VIN: C160.1 D2.2 F2.2 R821.2 U12.1(EN) U12.2(VIN)
VIN_CON: F2.1 H1.2
ADC1: U1.87(LSADC-CH1) U16.10
ADC_CH0: C209.1 R820.1 R821.1 U1.88(LSADC-CH0)
BOOT_SEL0: R23.2 U1.22(LCD-DE)
BOOT_SEL1: R807.2 U1.19(LCD-CLK)
DC0V9_EN: C211.2 R832.1 U14.1(EN)
DC0V9_FB: R811.1 R812.2 U14.5(FB)
DC0V9_LX: L7.1 U14.3(LX)
DC1V8_FB: R814.2 R815.1 U15.5(FB)
DC1V8_LX: L8.1 U15.3(LX)
ETH_1: C192.2 U17.1
ETH_2: C193.2 U17.2
ETH_3: C194.2 U17.3
ETH_6: C195.2 U17.4
ETH_MDI_AN: C193.1 R817.2 U1.26(ETH-MDI-AN)
ETH_MDI_AP: C192.1 R816.2 U1.27(ETH-MDI-AP)
ETH_MDI_BN: C195.1 R819.2 U1.23(ETH-MDI-BN)
ETH_MDI_BP: C194.1 R818.2 U1.24(ETH-MDI-BP)
I2C0_SCL: R822.2 U1.34(I2C0-SCL) U3.G2(SCK)
I2C0_SDA: R823.2 U1.33(I2C0-SDA) U3.E2(SDI)
I2C2_SCL: R824.2 U1.30(I2C2-SCL) U17.6
I2C2_SDA: R825.2 U1.31(I2C2-SDA) U17.5
MIPI_RX_CK0N: U1.40(MIPI-RX-CK0N) U3.U8(DMCKM)
MIPI_RX_CK0P: U1.39(MIPI-RX-CK0P) U3.V8(DMCKP)
MIPI_RX_D0N: U1.42(MIPI-RX-D0N) U3.U6(DMOMA)
MIPI_RX_D0P: U1.41(MIPI-RX-D0P) U3.V6(DMOPA)
MIPI_RX_D2N: U1.44(MIPI-RX-D2N) U3.U10(DMOMB)
MIPI_RX_D2P: U1.43(MIPI-RX-D2P) U3.V10(DMOPB)
SDIO0_CARD_DETECT: R831.2 U1.61(SDIO0-CARD-DETECT) U16.9
SDIO0_CCLK_OUT: R27.2 U1.57(SDIO0-CCLK-OUT) U16.5
SDIO0_CCMD: R830.2 U1.56(SDIO0-CCMD) U16.4
SDIO0_CDATA0: R829.2 U1.58(SDIO0-CDATA0) U16.6
SDIO0_CDATA1: R828.2 U1.60(SDIO0-CDATA1) U16.8
SDIO0_CDATA2: R827.2 U1.54(SDIO0-CDATA2) U16.2
SDIO0_CDATA3: R826.2 U1.55(SDIO0-CDATA3) U16.3
SENSOR_CLK: R835.2 U1.35(SENSOR-CLK)
SENSOR_RSTN: U1.36(SENSOR-RSTN) U3.B2(XCLR)
SFC_BOOT_MODE: R25.2 U1.11(LCD-DATA2)
SFC_CLK: R29.2 U1.67(SFC-CLK) U2.6(CLK)
SFC_CSN: R33.1 U1.65(SFC-CSN) U2.1(CS#)
SFC_HOLD_IO3: R34.1 U1.66(SFC-HOLD-IO3) U2.7(IO3)
SFC_MISO_IO1: U1.64(SFC-MISO-IO1) U2.2(DO)
SFC_MOSI_IO0: U1.68(SFC-MOSI-IO0) U2.5(DI)
SFC_WP_IO2: R35.2 U1.63(SFC-WP-IO2) U2.3(IO2)
TEST_MODE: R32.2 R834.1 U1.28(ETH-LINK-ACT-LED)
UART0_RXD: H1.3 U1.74(UART0-RXD)
UART0_TXD: H1.4 U1.73(UART0-TXD)
UART1_RXD: H1.7 U1.10(LCD-DATA1)
UART1_TXD: H1.8 U1.9(LCD-DATA0)
UART2_RXD: H1.5 U1.81(JTAG-TRSTN)
UART2_TXD: H1.6 U1.82(JTAG-TCK)
UPDATE_MODE: R30.1 U1.72(GPIO0-0)
USB_DM: U1.52(USB-DM) U11.4(DM)
USB_DP: U1.51(USB-DP) U11.5(DP)
$1N2212: C177.2 R65.2 X11.3
$1N2213: R65.1 U1.7(XOUT)
$1N2223: C178.2 U1.6(XIN) X11.1
$1N8351: C86.2 U3.B4(VRLFR)
$1N8352: C83.2 U3.A11(VBGR)
$1N8353: C85.2 U3.A5(VLOADLM)
$1N8354: C84.2 U3.A4(VRLST)
$1N8385: R835.1 U3.J1(INCK)
$1N8396: C155.2 R808.2 U13.3(EN)
$1N8404: C118.1 R74.1 R75.2 U13.5(FB)
$1N8406: C120.2 U13.4(NR)
$1N12820: C14.2 L4.1 U1.50(AVDD33-AC-U2)
$1N13177: C161.2 U12.8(SS/TR)
$1N13350: R809.2 R810.1 U12.6(FB)
$1N16495: C191.1 R816.1 R817.1 R818.1 R819.1
$1N26063: LED1.1(K) R833.1
$1N26212: LED2.2(A) R834.2

Not connected (* = marked no-connect by the designer): U1 1(AVDD-BAT)* 2(RTC-XIN)* 3(RTC-XOUT)* 12(LCD-DATA3)* 14(LCD-DATA4)* 15(LCD-DATA5)* 16(LCD-DATA6)* 18(LCD-DATA7)* 20(LCD-HS)* 21(LCD-VS)* 29(ETH-LINK-STA-LED)* 46(AC-VREF)* 48(AC-MICBIAS)* 49(AC-OUTL)* 69(SYS-RSTN-OUT)* 70(PWM0)* 71(PWM1)* 83(JTAG-TMS)* 85(JTAG-TDI)* 86(JTAG-TDO)*; U3 A1(NC)* A2(NC)* A14(NC)* B1(TENABLE)* B11(TAMON)* B14(NC)* C2(XTRIG)* D1(SDO)* G1(XHS)* H1(XVS)* J2(TOUT)* L1(DLOPA)* L2(DLOMA)* N1(DLOPB)* N2(DLOMB)* P1(DLCKP)* P2(DLCKM)* R1(DLOPC)* R2(DLOMC)* U1(DLOPD)* U2(DLOMD)* U5(DMOMC)* U11(DMOMD)* V1(NC)* V5(DMOPC)* V11(DMOPD)* V13(NC)* V14(NC)*; U11 2(NC/ANT)*; U12 7(PG)*

## Notes on the sheet
- To Ext. Board
- *If don't use Ext. board, the connectors here and components with NC value can be not installed
- 80
- 13
- PWR
- 77
- 53
- 37
- 53
- 62
- SoC Config
- Sensor Power
- SoC Power
- 0V9和1V8DCDC实际使用ETA3413和1uH/2A电感
- Sensor
- Main SoC
- USB Wi-Fi Adaptor
